# EAGLE design ibm (EAGLE 9.6.2)
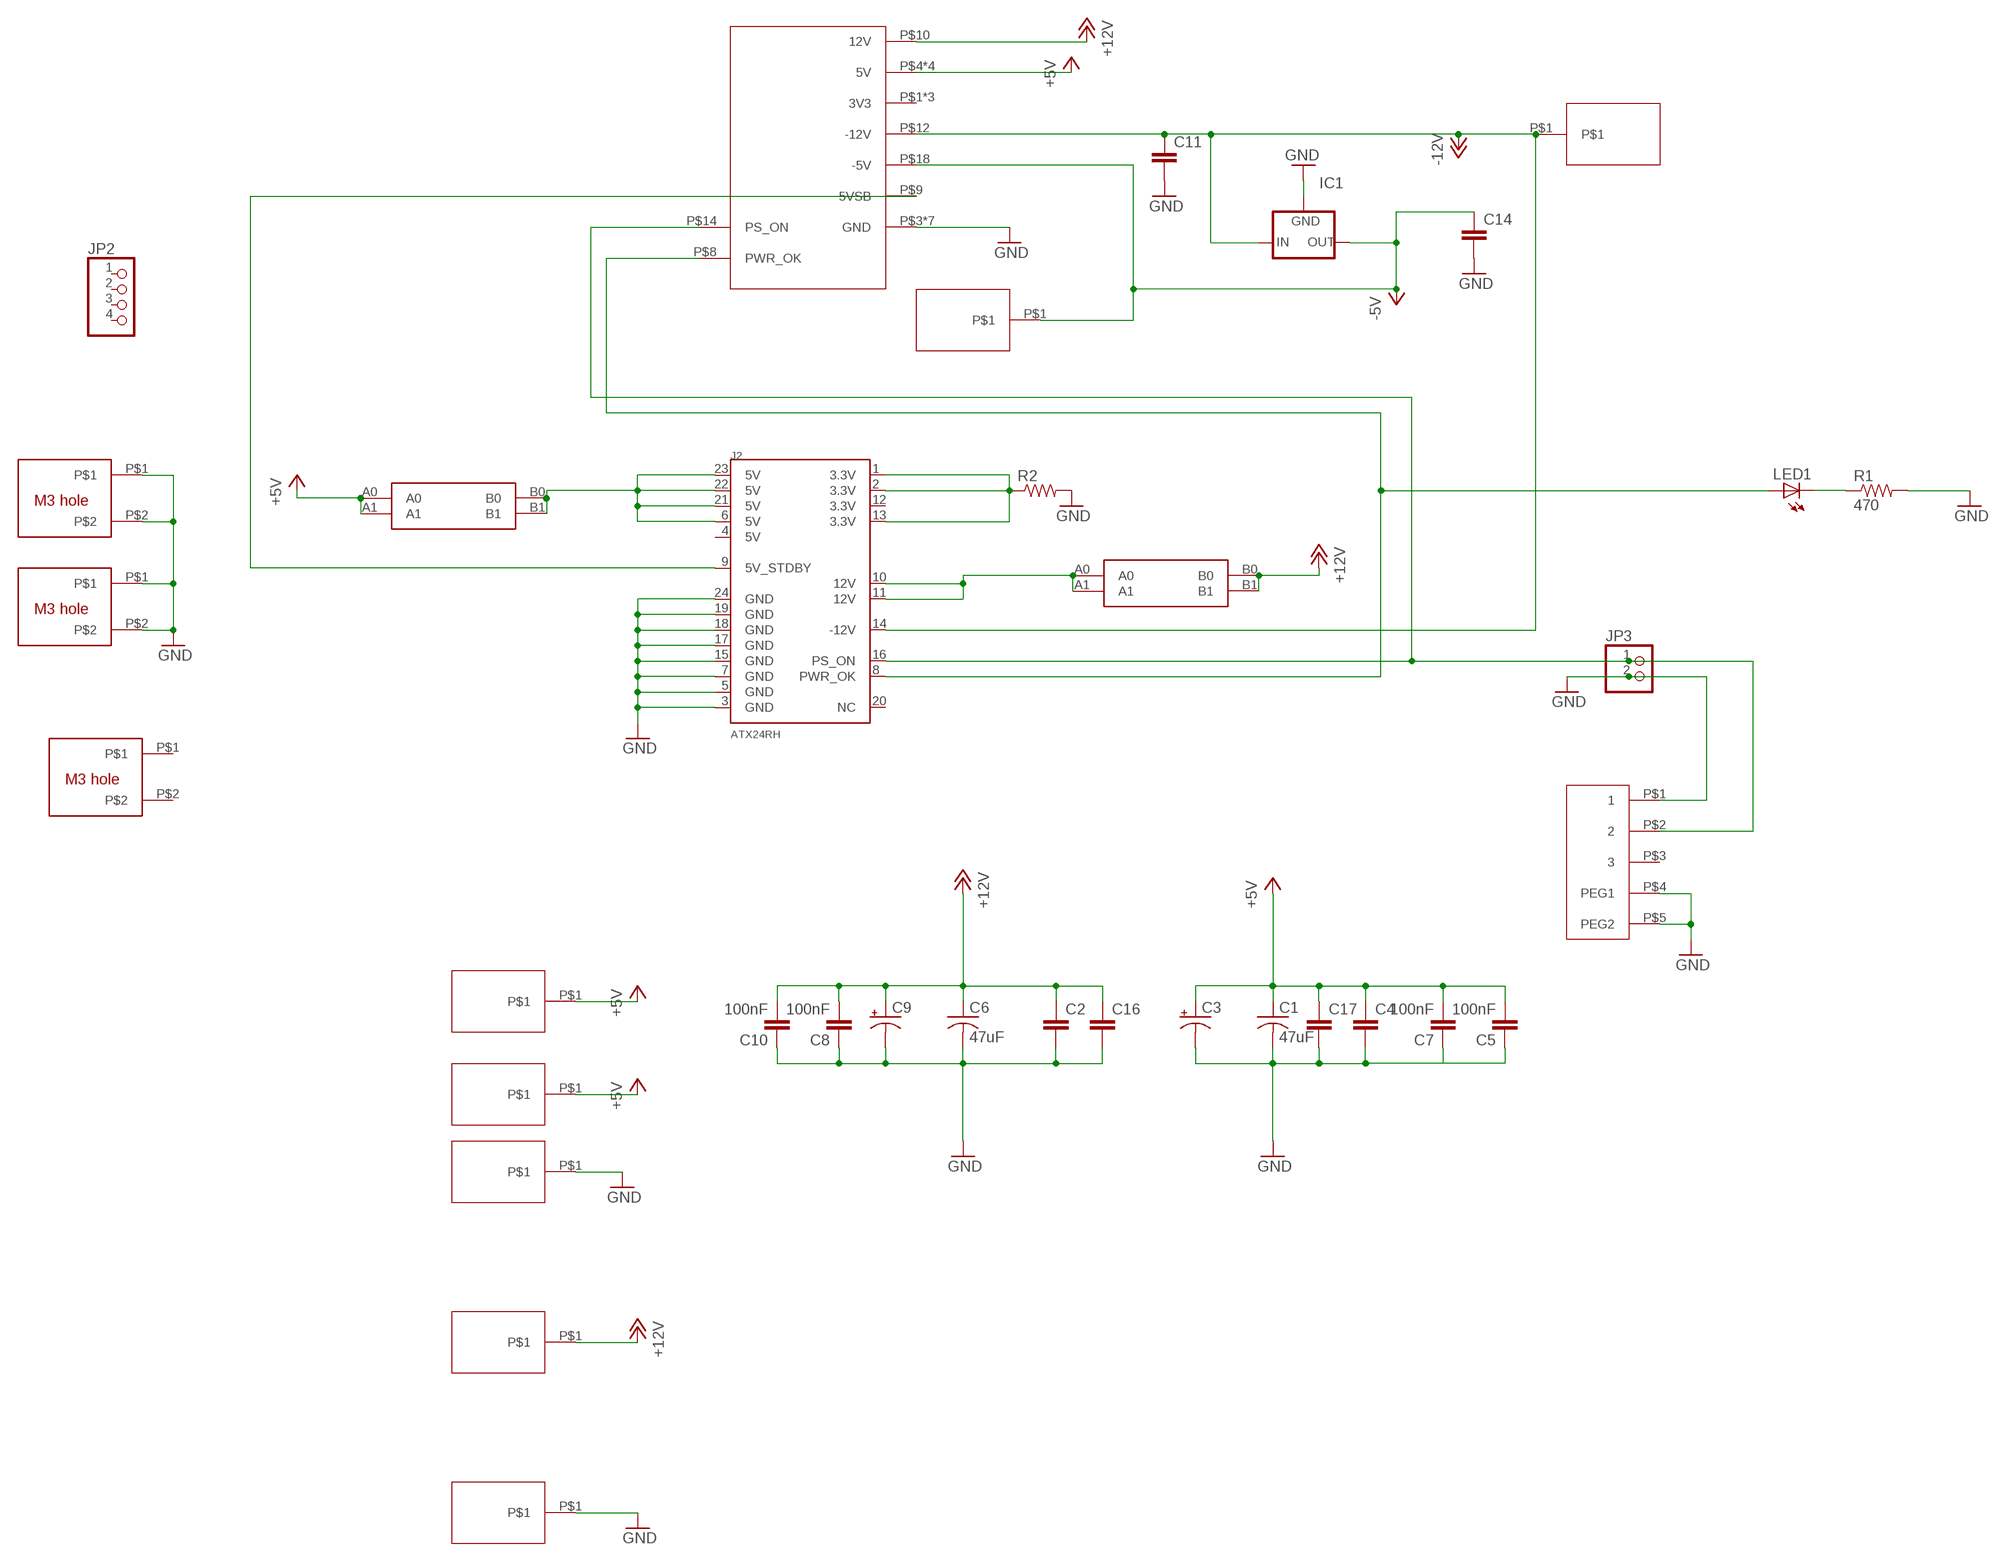
[diagram p0: schematic, sheet 1]

## Parts
C1  47uF  C-USC1210  [C1210]
C2  C5/2.5  [C5B2.5]
C3  CPOL-USE3.5-8  [E3,5-8]
C4  C5/2.5  [C5B2.5]
C5  100nF  CAP0805  [0805@1]
C6  47uF  C-USC1210  [C1210]
C7  100nF  CAP0805  [0805@1]
C8  100nF  CAP0805  [0805@1]
C9  CPOL-USE3.5-8  [E3,5-8]
C10  100nF  CAP0805  [0805@1]
C11  C5/2.5  [C5B2.5]
C14  C5/2.5  [C5B2.5]
C16  C5/2.5  [C5B2.5]
C17  C5/2.5  [C5B2.5]
IC1  79XXS  [79XXS]
J2  ATX24RH  [ATX24_RIGHT_ANGLE]
JP2  PINHD-1X4/90  [1X04/90]
JP3  PINHD-1X2/90  [1X02/90]
LED1  LED5MM  [LED5MM]
R1  470  R-US_0207/10  [0207/10]
R2  R-US_0411/15  [0411/15]
U$1  20PEDGE  [20P_EDGE]
U$2  CAR_FUSE_HOLDER3IN1  [FUSE_HOLDER_3IN1]
U$3  ISA  [ISAPAD]
U$4  ROCKSW  [ROCKSW]
U$5  M3_MOUNTING_HOLE  [M3_MOUNTING_HOLE_PACK]
U$6  M3_MOUNTING_HOLE  [M3_MOUNTING_HOLE_PACK]
U$7  ISA  [ISAPAD]
U$8  CAR_FUSE_HOLDER3IN1  [FUSE_HOLDER_3IN1]
U$9  ISA  [ISAPAD]
U$10  ISA  [ISAPAD]
U$11  M3_MOUNTING_HOLE  [M3_MOUNTING_HOLE_PACK]
U$13  ISA  [ISAPAD]
U$15  ISA  [ISAPAD]
U$16  ISA  [ISAPAD]

## Nets
+5V: C1.1 C3.+ C4.1 C5.2 C7.2 C17.1 U$1.P$4(5V) U$1.P$6(5V) U$1.P$19(5V) U$1.P$20(5V) U$3.P$1 U$8.A0 U$8.A1 U$16.P$1
+12V: C2.1 C6.1 C8.2 C9.+ C10.2 C16.1 U$1.P$10(12V) U$2.B0 U$2.B1 U$13.P$1
-5V: C14.1 IC1.OUT U$1.P$18(-5V) U$7.P$1
-12V: C11.1 IC1.IN J2.14(-12V) U$1.P$12(-12V) U$10.P$1
GND: C1.2 C2.2 C3.- C4.2 C5.1 C6.2 C7.1 C8.1 C9.- C10.1 C11.2 C14.2 C16.2 C17.2 IC1.GND J2.3(GND) J2.5(GND) J2.7(GND) J2.15(GND) J2.17(GND) J2.18(GND) J2.19(GND) J2.24(GND) JP3.2 R1.2 R2.2 U$1.P$3(GND) U$1.P$5(GND) U$1.P$7(GND) U$1.P$13(GND) U$1.P$15(GND) U$1.P$16(GND) U$1.P$17(GND) U$4.P$1 U$4.P$4(PEG1) U$4.P$5(PEG2) U$5.P$1 U$5.P$2 U$6.P$1 U$6.P$2 U$9.P$1 U$15.P$1
N$1: J2.1(3.3V) J2.2(3.3V) J2.13(3.3V) R2.1
N$3: J2.16(PS_ON) JP3.1 U$1.P$14(PS_ON) U$4.P$2
N$4: J2.8(PWR_OK) LED1.A U$1.P$8(PWR_OK)
N$5: J2.9(5V_STDBY) U$1.P$9(5VSB)
N$6: J2.6(5V) J2.21(5V) J2.22(5V) J2.23(5V) U$8.B0 U$8.B1
N$8: J2.10(12V) J2.11(12V) U$2.A0 U$2.A1
N$12: LED1.K(C) R1.1
Unconnected: J2.4(5V) J2.12(3.3V) J2.20(NC) JP2.1 JP2.2 JP2.3 JP2.4 U$1.P$1(3V3) U$1.P$2(3V3) U$1.P$11(3V3) U$4.P$3 U$11.P$1 U$11.P$2

## Library data of the parts
C1 C6 = clock:C-US: CAPACITOR, American symbol
C2 C4 C11 C14 C16 C17 = capacitor-wima:C: CAPACITOR naming: grid - package width
C3 C9 = adafruit_changed:CPOL-US: POLARIZED CAPACITOR, American symbol
C5 C7 C8 C10 = clock:CAP: Capacitor Standard 0603 ceramic capacitor, and 0.1" leaded capacitor.
IC1 = v-reg:79XXS: VOLTAGE REGULATOR
J2 = macse:ATX24: ATX24 Pin Power Supply Connector This is a good connector for connecting a computer power supply to a PCB. It's massive, but provides many amps of power at 5V and 12V. SKU: PRT-09498
JP2 = pinhead:PINHD-1X4: PIN HEADER
JP3 = pinhead:PINHD-1X2: PIN HEADER
LED1 = adafruit:LED: LED OSRAM: - CHIPLED LG R971, LG N971, LY N971, LG Q971, LY Q971, LO R971, LY R971 LH N974, LH R974 LS Q976, LO Q976, LY Q976 LO Q996 - Hyper CHIPLED LW Q18S LB Q993, LB Q99A, LB R99A - SideLED LS A670, LO A670, LY A670, LG A670, LP A670 LB A673, LV A673, LT A673, LW A673 LH A674 LY A675 LS A676, LA A676, LO A676, LY A676, LW A676 LS A679, LY A679, LG A679 - Hyper Micro SIDELED® LS Y876, LA Y876, LO Y876, LY Y876 LT Y87S - SmartLED LW L88C, LW L88S LB L89C, LB L89S, LG L890 LS L89K, LO L89K, LY L89K LS L896, LA L896, LO L896, LY L896 - TOPLED LS T670, LO T670, LY T670, LG T670, LP T670 LSG T670, LSP T670, LSY T670, LOP T670, LYG T670 LG T671, LOG T671, LSG T671 LB T673, LV T673, LT T673, LW T673 LH T674 LS T676, LA T676, LO T676, LY T676, LB T676, LH T676, LSB T676, LW T676 LB T67C, LV T67C, LT T67C, LS T67K, LO T67K, LY T67K, LW E67C LS E67B, LA E67B, LO E67B, LY E67B, LB E67C, LV E67C, LT E67C LW T67C LS T679, LY T679, LG T679 LS T770, LO T770, LY T770, LG T770, LP T770 LB T773, LV T773, LT T773, LW T773 LH T774 LS E675, LA E675, LY E675, LS T675 LS T776, LA T776, LO T776, LY T776, LB T776 LHGB T686 LT T68C, LB T68C - Hyper Mini TOPLED® LB M676 - Mini TOPLED Santana® LG M470 LS M47K, LO M47K, LY M47K Source: http://www.osram.convergy.de/
R1 = adafruit:R-US_: RESISTOR, American symbol
R2 = adafruit_changed:R-US_: RESISTOR, American symbol
U$1 = apricot:20PEDGE
U$2 U$8 = atx_power_control:CAR_FUSE_HOLDER
U$3 U$7 U$9 U$10 U$13 U$15 U$16 = blade:ISA
U$4 = apricot:ROCKSW
U$5 U$6 U$11 = apricot:M3_MOUNTING_HOLE

## Board
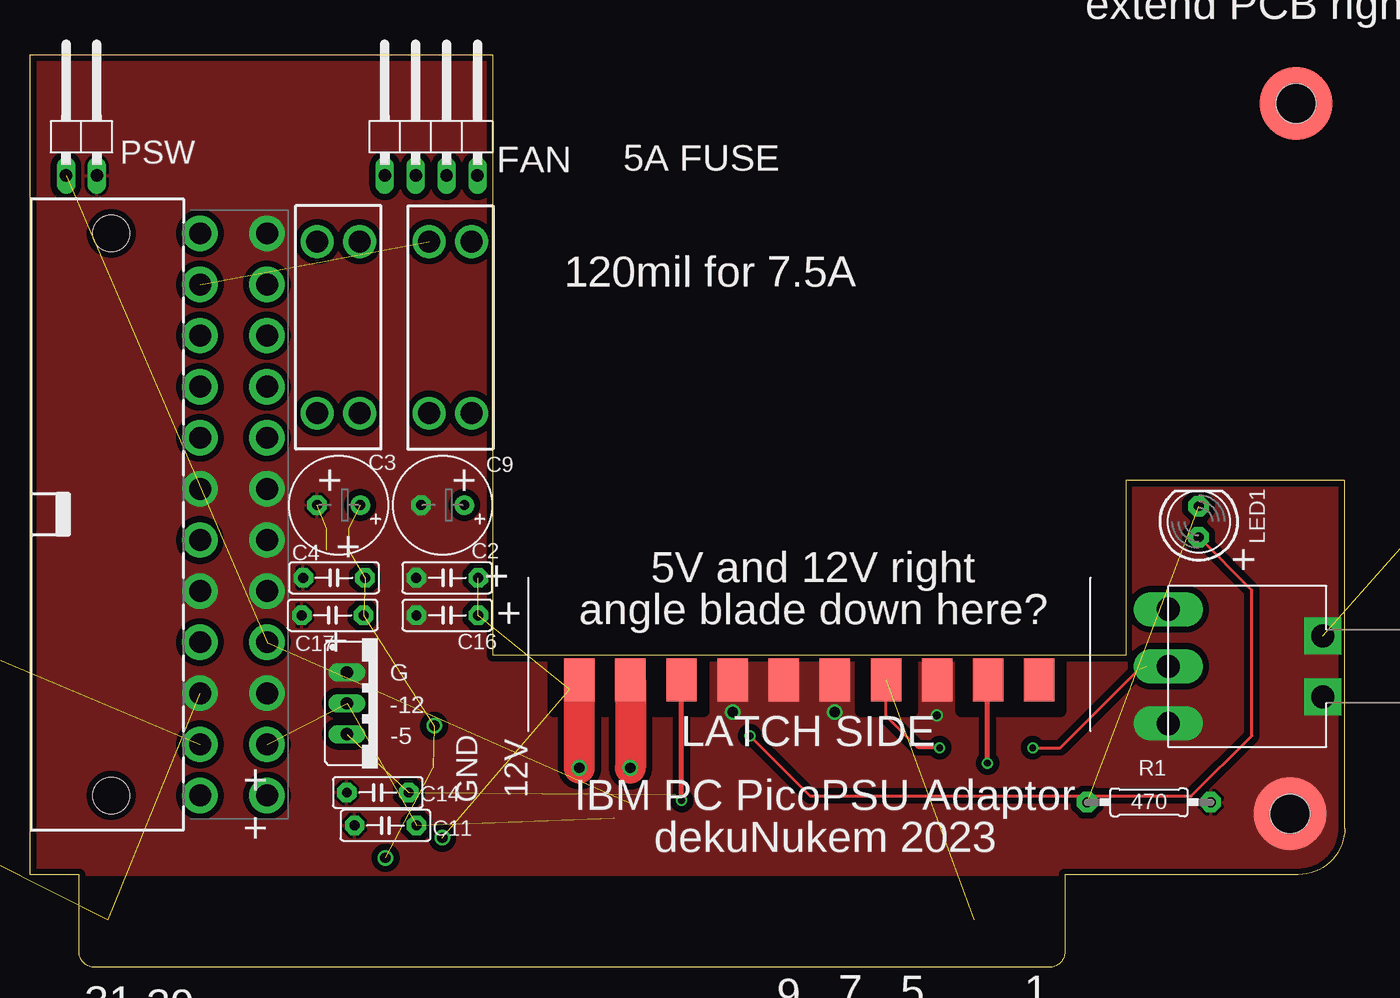
[diagram p1: board, top side]
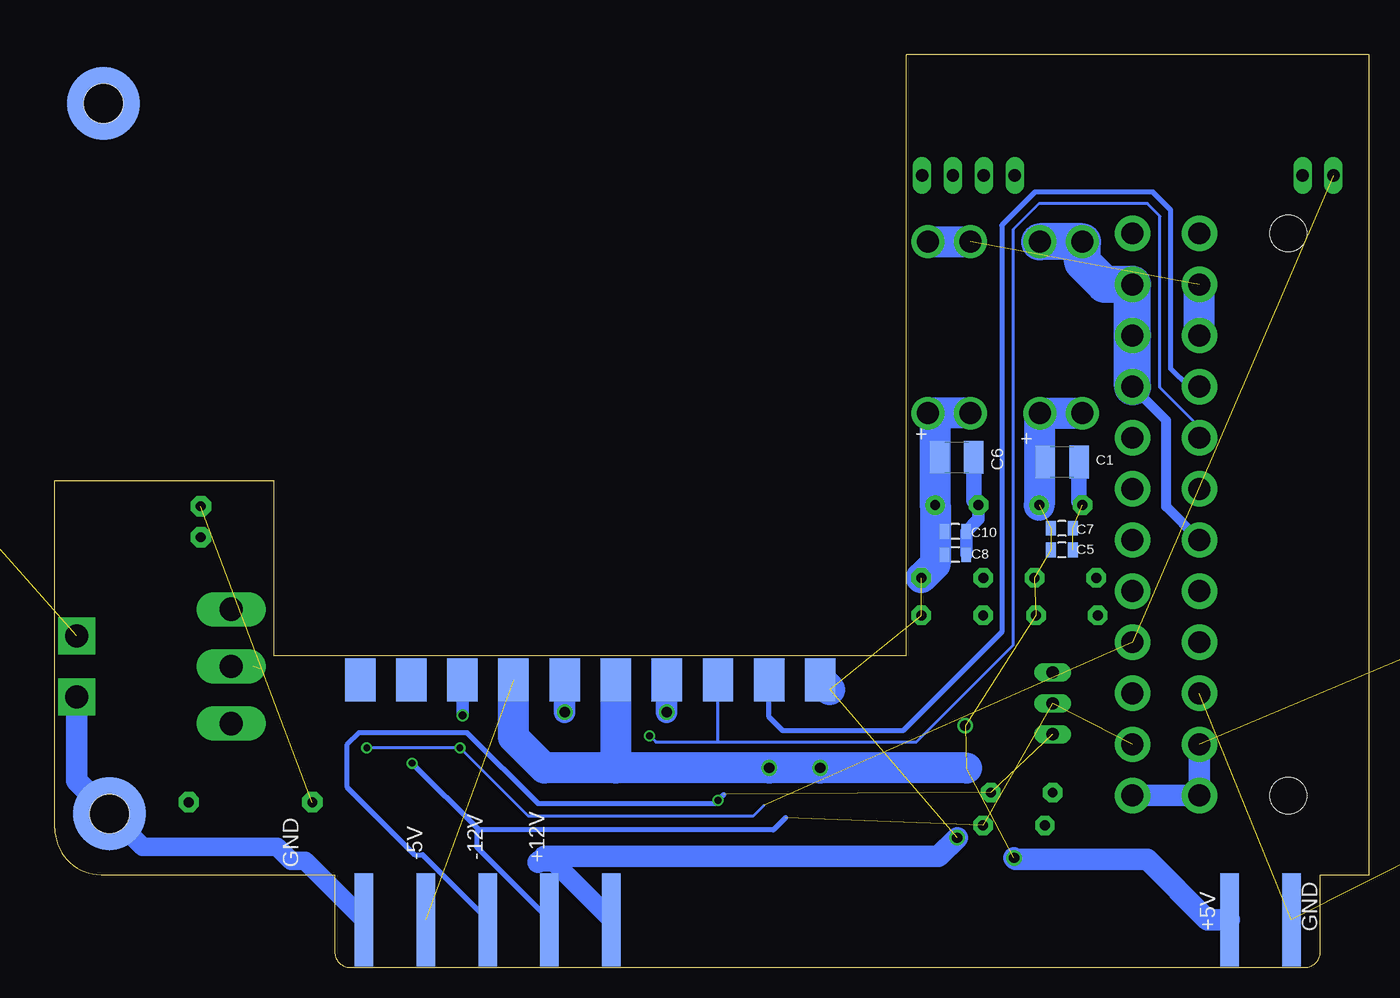
[diagram p2: board, bottom side, seen from below]

Size 108 x 75 mm. Coordinates in mm from the lower left corner, seen from the top.
Outline: 0,75 38,75 38,25.62 90,25.62 90,40 108,40 108,11.43 arc-90 104.19,7.62 85,7.62 85,1.27 arc-90 83.73,0 5.27,0 arc-90 4,1.27 4,7.62 0,7.62 0,75
Copper layers (1*16): Top 0.035mm / dielectric 1.5mm / Bottom 0.035mm
Design rules "deku_2layer_6mil *": minimum track width 6mil, minimum drill 15mil, track to track 20mil, track to pad 6mil, pad to pad 6mil, via to via 6mil, smd to smd 6mil, copper to edge 10mil, drill to drill 6mil, minimum pad ring 7mil, minimum via ring 7mil, stop-mask expansion 4mil, vias tented up to drill 25mil, thermal gap 10mil
tRestrict: area 76.5,21.1 to 80.7,26; area 68.3,21.1 to 72.5,26; area 51.1,21.1 to 55.3,26; area 47.2,21.1 to 51.4,26; area 43,21.1 to 47.2,26; area 80.5,21.1 to 84.6,26

### Footprints (pad centres in the part's own frame; a part is rotated, then mirrored left to right if it is on the bottom)
C1210 = smd 1.6 x 2.7: 1 -1.4,0; 2 1.4,0
C5B2.5 = drill 0.813 pad 1.6 octagon: 1 -2.54,0; 2 2.54,0
E3,5-8 = drill 0.813 pad 1.6: + -1.778,0 | drill 0.813 pad 1.6 octagon: - 1.778,0
0805@1 = smd 0.8 x 1.2: 1 -0.9,0; 2 0.9,0
79XXS = drill 1.016 long: GND -2.54,-2.54; IN 0,-2.54; OUT 2.54,-2.54
ATX24_RIGHT_ANGLE = drill 1.8 pad 2.9: 1 23.1,4.76; 2 18.9,4.76; 3 14.7,4.76; 4 10.5,4.76; 5 6.3,4.76; 6 2.1,4.76; 7 -2.1,4.76; 8 -6.3,4.76; 9 -10.5,4.76; 10 -14.7,4.76; 11 -18.9,4.76; 12 -23.1,4.76; 13 23.1,10.26; 14 18.9,10.26; 15 14.7,10.26; 16 10.5,10.26; 17 6.3,10.26; 18 2.1,10.26; 19 -2.1,10.26; 20 -6.3,10.26; 21 -10.5,10.26; 22 -14.7,10.26; 23 -18.9,10.26; 24 -23.1,10.26 | hole 3: -23.1,-2.54; 23.1,-2.54
1X04/90 = drill 1.016 long: 1 -3.81,-3.81; 2 -1.27,-3.81; 3 1.27,-3.81; 4 3.81,-3.81
1X02/90 = drill 1.016 long: 1 -1.27,-3.81; 2 1.27,-3.81
LED5MM = drill 0.813 pad 1.676 octagon: A -1.27,0; K 1.27,0
0207/10 = drill 0.813 pad 1.676 octagon: 1 -5.08,0; 2 5.08,0
0411/15 = drill 0.914 octagon: 1 -7.62,0; 2 7.62,0
20P_EDGE = smd 2.5 x 3.5 bottom: P$1 -18.9,0; P$2 -14.7,0; P$3 -10.5,0; P$4 -6.3,0; P$5 -2.1,0; P$6 2.1,0; P$7 6.3,0; P$8 10.5,0; P$9 14.7,0; P$10 18.9,0 | smd 2.5 x 3.5: P$11 -18.9,0; P$12 -14.7,0; P$13 -10.5,0; P$14 -6.3,0; P$15 -2.1,0; P$16 2.1,0; P$17 6.3,0; P$18 10.5,0; P$19 14.7,0; P$20 18.9,0
FUSE_HOLDER_3IN1 = drill 1.8: A0 -7.05,1.75; A1 -7.05,-1.75; B0 7.05,1.75; B1 7.05,-1.75
ISAPAD = smd 1.524 x 7.62: P$1 0,0
ROCKSW = drill 1.9 long: P$1 0,4.7; P$2 0,0; P$3 0,-4.7 | drill 1.9 pad 3.048 square: P$4 -12.7,2.5; P$5 -12.7,-2.5
M3_MOUNTING_HOLE_PACK = smd 6 x 6 bottom: P$1 0,0 | smd 6 x 6: P$2 0,0 | hole 3.2: 0,0

### Placement (x,y rotation side)
C1  25.24,41.54 0 bottom
C2  34.25,32.01 180 top
C3  25.32,37.98 180 top
C4  24.95,32.01 180 top
C5  25.24,34.3 180 bottom
C6  33.87,41.92 0 bottom
C7  25.24,36.08 180 bottom
C8  34,33.92 180 bottom
C9  33.87,37.98 180 top
C10  34,35.82 180 bottom
C11  29.18,11.66 180 top
C14  28.54,14.36 180 top
C16  34.25,28.93 180 top
C17  24.83,28.93 180 top
IC1  28.54,21.69 270 top
J2  9.18,37.22 270 top
JP2  32.93,68.88 0 top
JP3  4.19,68.88 0 top
LED1  96,36.62 90 top
R1  91.91,13.56 0 top
R2  -22.23,25.95 270 bottom  (outside the outline)
U$1  64,23.62 180 top
U$2  34.5,52.59 270 top
U$3  77.51,3.91 0 bottom
U$4  93.5,24.73 180 top
U$5  122.5,45.62 270 top  (outside the outline)
U$6  103.5,12.62 270 top
U$7  72.42,3.91 180 bottom
U$8  25.31,52.59 90 top
U$9  82.59,3.91 180 bottom
U$10  67.35,3.91 180 bottom
U$11  104,71 0 top
U$13  62.27,3.91 180 bottom
U$15  6.39,3.91 180 bottom
U$16  11.47,3.91 180 bottom

### Tracks (layer width: path | path; a pad name or v marks a point on that pad's centre or on a via)
+5V  (via drill 0.85)  (8 unrouted)
  Top 2.54: U$1.P$19 v49.3,16.39 | v45.11,16.39 45.11,23.62 U$1.P$20
  Bottom 0.61: U$8.A1 27.06,41.96 C1.1
  Bottom 1.778: v29.18,8.99 29.05,8.87 18.23,8.87 13.27,3.91 U$16.P$1
  Bottom 2.54: 61.9,16.39 v49.3,16.39 v45.11,16.39 33.08,16.39 | U$1.P$6 61.9,16.39 | U$8.A0 U$8.A1 27.1,45.49 C3.+ | 61.9,16.39 67.79,16.39 70.3,18.9 U$1.P$4
  other vias: 33.18,19.85
+12V  (via drill 0.85)  (3 unrouted)
  Bottom 0.61: C2.1 36.79,32.03 C8.2 C10.2 34.9,37.23 C9.+ 35.27,38.36 C6.1
  Bottom 1.524: 68.27,8.61 66.96,8.61 U$13.P$1
  Bottom 1.778: v33.85,10.64 35.37,9.12 67.76,9.12 68.27,8.61
  Bottom 2.54: U$2.B1 U$2.B0 35.65,44.94 C9.+ 35.65,33.15 C2.1 | 44.32,22.84 U$1.P$10
-5V  (via drill 0.55)  (2 unrouted)
  Top 0.406: v53.51,13.72 U$1.P$18
  Bottom 0.406: U$7.P$1 77.76,9.25 78.42,9.25 84.01,14.84 84.01,18.27 83,19.28 74.11,19.28 68.3,13.47 53.75,13.47 v53.51,13.72 53.02,14.2
-12V  (via drill 0.55)  (3 unrouted)
  Top 0.406: v78.64,16.77 78.64,23.56 U$1.P$12
  Bottom 0.406: 47.94,12.3 48.96,11.28 73.15,11.28 | 73.15,11.28 73.35,11.08 73.35,9.91 U$10.P$1 | v78.64,16.77 73.15,11.28
GND  (via drill 0.65, 0.85)  (6 unrouted)
  Bottom 1.016: v74.48,20.71 74.48,23.62 U$1.P$13 | C8.1 C10.1 32.09,36.83 C9.-
  Bottom 1.27: C9.- 32.47,38.36 C6.2 | C3.- 23.84,38.27 C1.2
  Bottom 1.524: U$9.P$1 87.42,8.74 88.59,8.74 89.73,9.88 100.76,9.88 U$6.P$2
  Bottom 1.778: U$1.P$17 57.72,23.6 v57.72,20.96 | v66.1,20.96 U$1.P$5 | U$4.P$4 106.2,15.32 U$6.P$2
  pour Top (isolate 0.508): -16.13,7.62 108.52,7.62 108.52,82.95 -16.13,82.99
  pour Top (no thermals): 32.86,27.79 29.81,27.79 29.81,33.25 32.86,33.25
  pour Top (no thermals): 21.68,27.79 19.27,27.79 19.27,33 21.68,33
  pour Top (no thermals): 32.99,36.68 30.96,36.68 30.96,39.47 32.99,39.47
  pour Top (no thermals): 22.19,37.06 20.28,37.06 20.28,39.22 22.19,39.22
  pour Top (no thermals): 21.8,9.63 21.3,9.63 19.27,9.63 19.27,12.17 21.8,12.17
  pour Top (no thermals): 21.93,12.93 19.27,12.93 19.27,15.72 21.93,15.72
  pour Top (no thermals): 28.04,23.22 23.97,23.22 23.97,25.63 28.04,25.63
N$1  (1 unrouted)
  Bottom 1.778: J2.2 J2.1 J2.13
N$3  (via drill 0.55)  (3 unrouted)
  Top 0.254: v74.7,18.04 72.93,18.04 70.3,20.67 U$1.P$14 | v82.36,18.04 84.64,18.04 91.13,24.53 | 91.71,24.73 U$4.P$2
  Bottom 0.254: v82.36,18.04 v74.7,18.04 69.08,12.42 50.61,12.42 49.72,13.31
N$4  (via drill 0.55)
  Top 0.254: v59.12,19.03 64.07,14.07 95.41,14.07 100.36,19.03 100.36,30.99 LED1.A
  Bottom 0.254: J2.8 13.94,44.41 17.18,47.65 17.18,61.73 18.21,62.77 27.12,62.77 29.26,60.63 29.26,26.47 37.21,18.52 53.5,18.52 | 53.5,18.52 U$1.P$8 | v59.12,19.03 58.61,18.52 53.5,18.52
N$5
  Bottom 0.406: J2.9 14.83,47.72 16.29,49.18 16.29,62.24 17.76,63.71 27.45,63.71 30.18,60.98 30.18,27.55 38.29,19.44 48.16,19.44 49.3,20.58 U$1.P$9
N$6
  Bottom 0.813: J2.6 16.67,37.85 16.67,44.95 J2.21
  Bottom 3.048: J2.21 J2.22 J2.23 21.72,56.12 23.56,57.96 U$8.B0 U$8.B1
N$8  (1 unrouted)
  Bottom 2.54: J2.10 J2.11 | U$2.A0 U$2.A1
N$12  (1 unrouted)

### Text on the board
tNames: GND and PG right angle blade here? | extend PCB right to here | PSW | 5A FUSE | FAN | 120mil for 7.5A | + | + | picoRC.com | + | + | + | 5V and 12V right / angle blade down here? | + | + | G | -12 | -5 | 1 and 0 on ISA bracket? / just cut out the outline | GND | 12V | + | 470 | IBM PC PicoPSU Adaptor / dekuNukem 2023 | + | 9 | 7 | 5 | 1 | 31 | 29
bNames: 3V3 LOAD | +12V | -12V | -5V | GND | GND | +5V